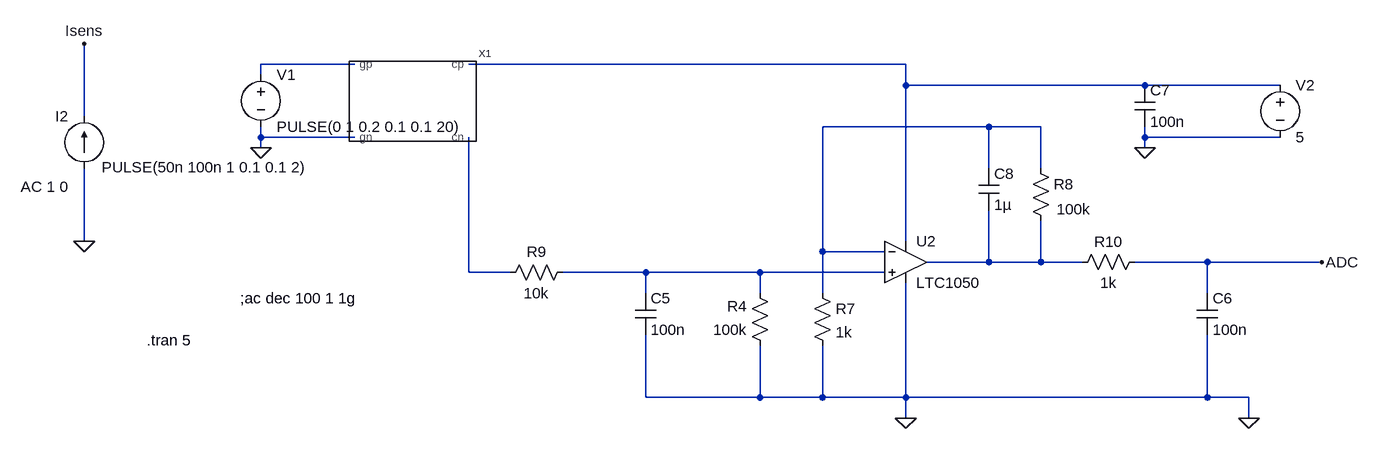
[diagram p0: schematic ampliyoplait_avec_capteur.asc]
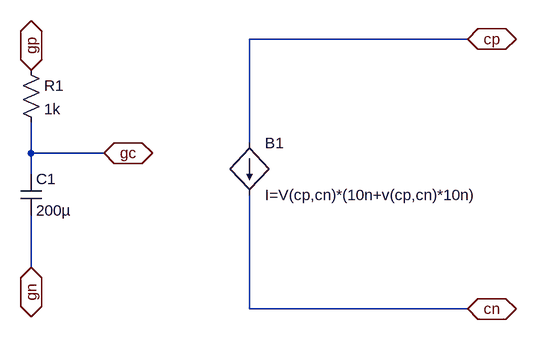
[diagram p1: sub-circuit le_gros_capteur.asc]
ampliyoplait_avec_capteur.asc, the LTspice schematic file:
Version 4
SHEET 1 2084 964
WIRE -16 400 -160 400
WIRE 832 400 160 400
WIRE -160 416 -160 400
WIRE 832 432 832 400
WIRE 1200 432 832 432
WIRE 1408 432 1200 432
WIRE -432 480 -432 368
WIRE 960 496 704 496
WIRE 1040 496 960 496
WIRE -160 512 -160 496
WIRE -16 512 -160 512
WIRE 1200 512 1200 496
WIRE 1408 512 1200 512
WIRE -160 528 -160 512
WIRE 1200 528 1200 512
WIRE 960 560 960 496
WIRE 1040 560 1040 496
WIRE -432 672 -432 560
WIRE 832 672 832 432
WIRE 704 688 704 496
WIRE 800 688 704 688
WIRE 960 704 960 624
WIRE 960 704 864 704
WIRE 1040 704 1040 640
WIRE 1040 704 960 704
WIRE 1104 704 1040 704
WIRE 1296 704 1184 704
WIRE 1472 704 1296 704
WIRE 160 720 160 512
WIRE 224 720 160 720
WIRE 432 720 304 720
WIRE 608 720 432 720
WIRE 800 720 608 720
WIRE 432 752 432 720
WIRE 608 752 608 720
WIRE 704 752 704 688
WIRE 1296 752 1296 704
WIRE 432 912 432 816
WIRE 608 912 608 832
WIRE 608 912 432 912
WIRE 704 912 704 832
WIRE 704 912 608 912
WIRE 832 912 832 736
WIRE 832 912 704 912
WIRE 1296 912 1296 816
WIRE 1296 912 832 912
WIRE 1360 912 1296 912
WIRE 832 944 832 912
WIRE 1360 944 1360 912
FLAG 832 944 0
FLAG 1472 704 ADC
FLAG 1360 944 0
FLAG 1200 528 0
FLAG -432 368 Isens
FLAG -432 672 0
FLAG -160 528 0
DATAFLAG 1008 912 ""
SYMBOL current -432 560 R180
WINDOW 0 24 80 Left 2
WINDOW 3 -344 2 Left 2
WINDOW 123 24 -28 Left 2
WINDOW 39 0 0 Left 0
SYMATTR InstName I2
SYMATTR Value PULSE(50n 100n 1 0.1 0.1 2)
SYMATTR Value2 AC 1 0
SYMBOL res 624 848 R180
WINDOW 0 36 76 Left 2
WINDOW 3 36 40 Left 2
SYMATTR InstName R4
SYMATTR Value 100k
SYMBOL cap 416 752 R0
SYMATTR InstName C5
SYMATTR Value 100n
SYMBOL res 688 736 R0
SYMATTR InstName R7
SYMATTR Value 1k
SYMBOL OpAmps\\LTC1050 832 640 R0
SYMATTR InstName U2
SYMBOL res 1024 544 R0
WINDOW 3 40 79 Left 2
SYMATTR Value 100k
SYMATTR InstName R8
SYMBOL res 320 704 R90
WINDOW 0 0 56 VBottom 2
WINDOW 3 32 56 VTop 2
SYMATTR InstName R9
SYMATTR Value 10k
SYMBOL cap 1280 752 R0
SYMATTR InstName C6
SYMATTR Value 100n
SYMBOL cap 1184 432 R0
SYMATTR InstName C7
SYMATTR Value 100n
SYMBOL cap 944 560 R0
SYMATTR InstName C8
SYMATTR Value 1µ
SYMBOL res 1200 688 R90
WINDOW 0 0 56 VBottom 2
WINDOW 3 32 56 VTop 2
SYMATTR InstName R10
SYMATTR Value 1k
SYMBOL voltage 1408 416 R0
WINDOW 123 0 0 Left 0
WINDOW 39 0 0 Left 0
SYMATTR InstName V2
SYMATTR Value 5
SYMBOL le_gros_capteur 112 480 R0
SYMATTR InstName X1
SYMBOL voltage -160 400 R0
WINDOW 123 0 0 Left 0
WINDOW 39 0 0 Left 0
SYMATTR InstName V1
SYMATTR Value PULSE(0 1 0.2 0.1 0.1 20)
TEXT -336 824 Left 2 !.tran 5
TEXT -192 760 Left 2 !;ac dec 100 1 1g

le_gros_capteur.asc, the sub-circuit schematic file:
Version 4
SHEET 1 880 680
WIRE 768 -16 432 -16
WIRE 432 144 432 -16
WIRE 96 160 96 112
WIRE 208 160 96 160
WIRE 96 192 96 160
WIRE 96 336 96 256
WIRE 432 400 432 224
WIRE 768 400 432 400
FLAG 208 160 gc
IOPIN 208 160 BiDir
FLAG 96 32 gp
IOPIN 96 32 BiDir
FLAG 96 336 gn
IOPIN 96 336 BiDir
FLAG 768 -16 cp
IOPIN 768 -16 BiDir
FLAG 768 400 cn
IOPIN 768 400 BiDir
SYMBOL res 80 16 R0
SYMATTR InstName R1
SYMATTR Value 1k
SYMBOL cap 80 192 R0
SYMATTR InstName C1
SYMATTR Value 200µ
SYMBOL bi 432 144 R0
SYMATTR InstName B1
SYMATTR Value I=V(cp,cn)*(10n+v(cp,cn)*10n)

The netlist it stands for:
* ampliyoplait_avec_capteur.asc
I2 0 Isens PULSE(50n 100n 1 0.1 0.1 2) AC 1 0
R4 0 N006 100k
C5 N006 0 100n
R7 N003 0 1k
XU2 N006 N003 N002 0 N004 LTC1050  ; pins In+ In- V+ V- OUT
R8 N003 N004 100k
R9 N006 N005 10k
C6 ADC 0 100n
C7 N002 0 100n
C8 N003 N004 1µ
R10 ADC N004 1k
V2 N002 0 5
XX1 N002 N005 N001 0 le_gros_capteur
V1 N001 0 PULSE(0 1 0.2 0.1 0.1 20)

* block symbol definitions
.subckt le_gros_capteur cp cn gp gn
R1 gp gc 1k
C1 gc gn 200µ
B1 cp cn I=V(cp,cn)*(10n+v(cp,cn)*10n)
.ends le_gros_capteur

.tran 5
;ac dec 100 1 1g
.lib LTC.lib
.backanno
.end